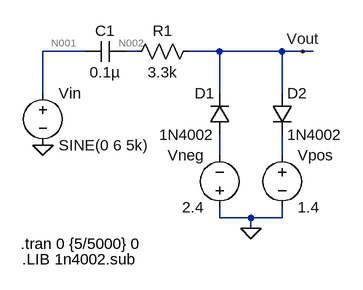
[diagram p0: schematic Pre3.asc]
Pre3.asc, the LTspice schematic file:
Version 4
SHEET 1 880 680
WIRE 96 80 32 80
WIRE 176 80 160 80
WIRE 304 80 256 80
WIRE 400 80 304 80
WIRE 432 80 400 80
WIRE 448 80 432 80
WIRE 32 144 32 80
WIRE 304 144 304 80
WIRE 400 144 400 80
WIRE 304 240 304 208
WIRE 400 240 400 208
WIRE 304 336 304 320
WIRE 352 336 304 336
WIRE 400 336 400 320
WIRE 400 336 352 336
WIRE 352 352 352 336
FLAG 352 352 0
FLAG 32 224 0
FLAG 432 80 Vout
SYMBOL voltage 32 128 R0
WINDOW 123 0 0 Left 0
WINDOW 39 0 0 Left 0
SYMATTR InstName Vin
SYMATTR Value SINE(0 6 5k)
SYMBOL cap 160 64 R90
WINDOW 0 0 32 VBottom 2
WINDOW 3 32 32 VTop 2
SYMATTR InstName C1
SYMATTR Value 0.1µ
SYMBOL res 272 64 R90
WINDOW 0 0 56 VBottom 2
WINDOW 3 32 56 VTop 2
SYMATTR InstName R1
SYMATTR Value 3.3k
SYMBOL diode 320 208 R180
WINDOW 0 24 64 Left 2
WINDOW 3 24 0 Left 2
SYMATTR InstName D1
SYMATTR Value 1N4002
SYMBOL diode 384 144 R0
SYMATTR InstName D2
SYMATTR Value 1N4002
SYMBOL voltage 304 336 R180
WINDOW 0 24 96 Left 2
WINDOW 3 24 16 Left 2
WINDOW 123 0 0 Left 0
WINDOW 39 0 0 Left 0
SYMATTR InstName Vneg
SYMATTR Value 2.4
SYMBOL voltage 400 224 R0
WINDOW 123 0 0 Left 0
WINDOW 39 0 0 Left 0
SYMATTR InstName Vpos
SYMATTR Value 1.4
TEXT -2 376 Left 2 !.tran 0 {5/5000} 0
TEXT 0 400 Left 2 !.LIB 1n4002.sub

The netlist it stands for:
* Pre3.asc
Vin N001 0 SINE(0 6 5k)
C1 N002 N001 0.1µ
R1 Vout N002 3.3k
D1 N003 Vout 1N4002
D2 Vout N004 1N4002
Vneg 0 N003 2.4
Vpos N004 0 1.4
.model D D
.lib standard.dio
.tran 0 {5/5000} 0
.LIB 1n4002.sub
.backanno
.end

* Results of the author's LTspice run, read from the files saved beside the schematic
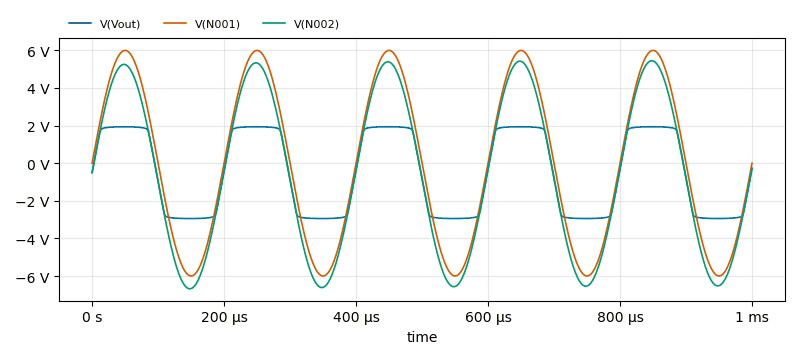
[diagram p1: Transient Analysis of Pre3.asc, plotted from the saved traces]
* Transient Analysis, 1 run:
*   V(Vout): min -2.942 V, max 1.939 V, average -528.8 mV, rms 2.251 V, last -275.1 mV
*   V(N001): min -5.999 V, max 5.998 V, average 23.91 µV, rms 4.24 V, last 0 V
*   V(N002): min -6.676 V, max 5.449 V, average -605.4 mV, rms 4.268 V, last -268.6 mV